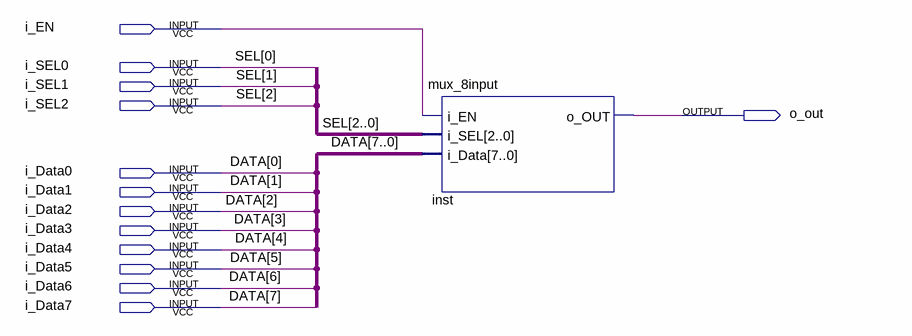
[diagram p0: schematic sheet]
// Quartus schematic mux_8bit_schematic.bdf as structural Verilog: 1 symbols, 13 pins
module mux_8bit_schematic (
  input  i_EN,
  input  i_SEL0,
  input  i_SEL1,
  input  i_SEL2,
  input  i_Data0,
  input  i_Data1,
  input  i_Data2,
  input  i_Data3,
  input  i_Data4,
  input  i_Data5,
  input  i_Data6,
  input  i_Data7,
  output o_out
);

  mux_8input inst (
    .i_EN(i_EN), .i_SEL({i_SEL2, i_SEL1, i_SEL0}),
    .i_Data({i_Data7, i_Data6, i_Data5, i_Data4, i_Data3, i_Data2, i_Data1, i_Data0}), .o_OUT(o_out));

  // Other names for the same wires on the sheet: DATA[7:0] = {i_Data7, i_Data6, i_Data5, i_Data4, i_Data3, i_Data2, i_Data1, i_Data0};
  //   SEL[2:0] = {i_SEL2, i_SEL1, i_SEL0}
endmodule
